# Altium schematic sheet MotorCell_noPow.SchDoc
size A3; DocumentNumber: 2; SheetNumber: 4; SheetTotal: 5
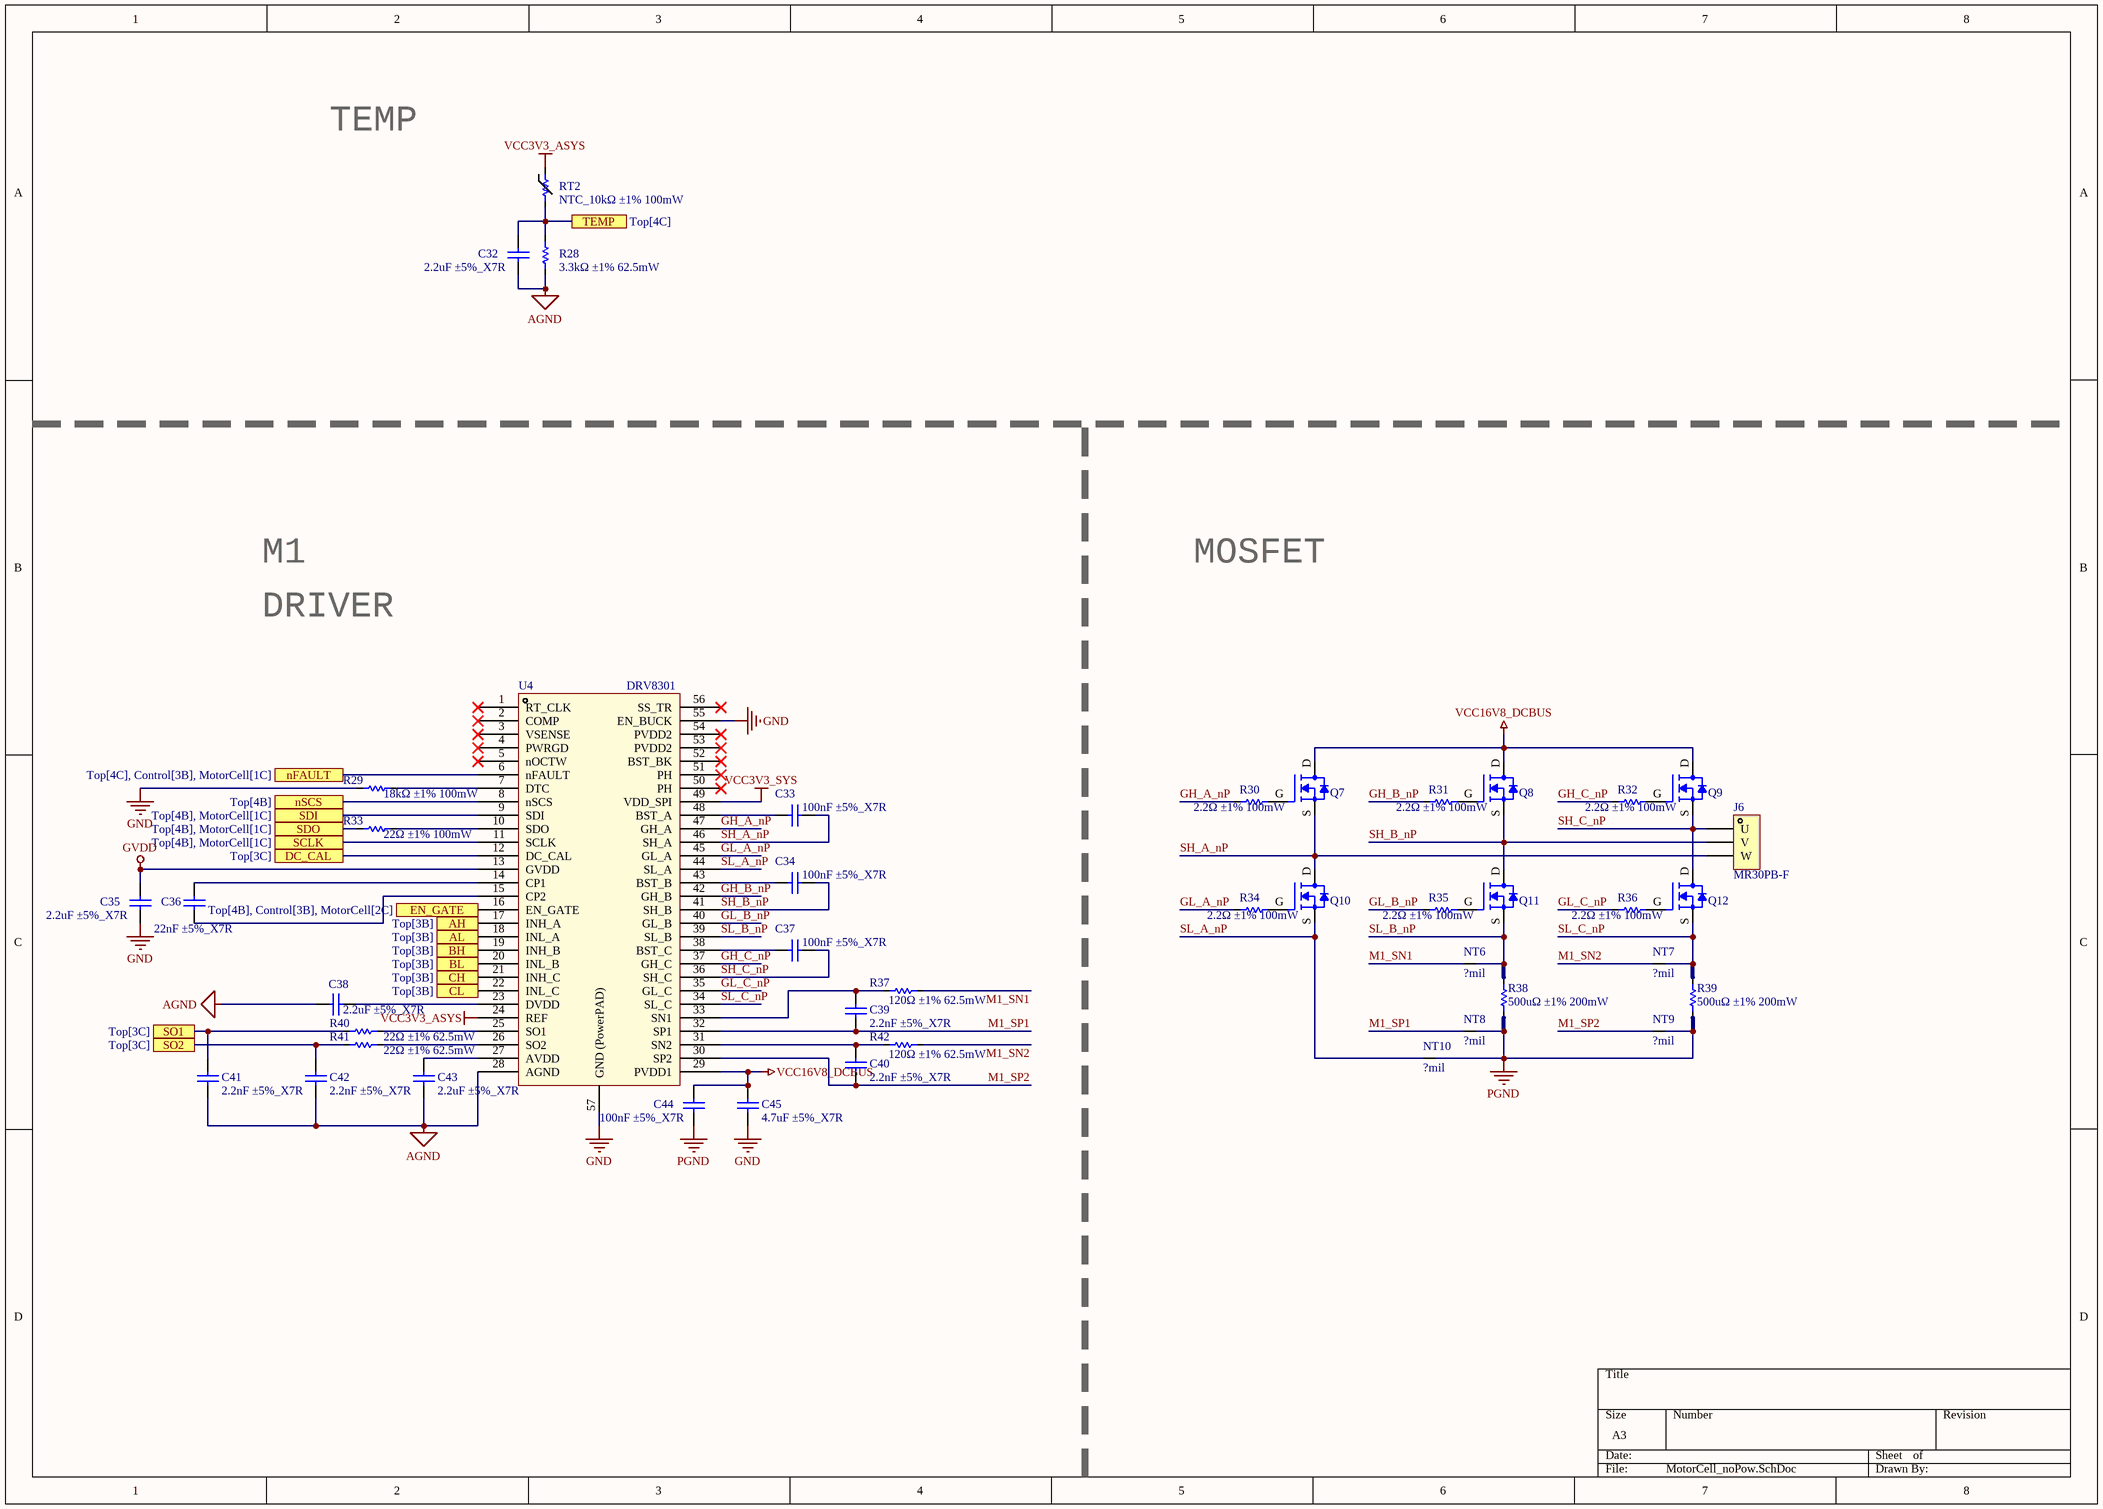
[diagram p0: MotorCell_noPow.SchDoc]

## Parts
C32  2.2uF ±5%_X7R  [C0402]
C33  100nF ±5%_X7R  [C0402]
C34  100nF ±5%_X7R  [C0402]
C35  2.2uF ±5%_X7R  [C0603]
C36  22nF ±5%_X7R  [C0402]
C37  100nF ±5%_X7R  [C0402]
C38  2.2uF ±5%_X7R  [C0603]
C39  2.2nF ±5%_X7R  [C0402]
C40  2.2nF ±5%_X7R  [C0402]
C41  2.2nF ±5%_X7R  [C0402]
C42  2.2nF ±5%_X7R  [C0402]
C43  2.2uF ±5%_X7R  [C0603]
C44  100nF ±5%_X7R  [C0402]
C45  4.7uF ±5%_X7R  [C0603]
J6  MR30PB-F  [MR30PB-F [Straight] [SMT]]
NT6  ?mil  [NETTIE_8mil]  (net tie, no BOM)
NT7  ?mil  [NETTIE_8mil]  (net tie, no BOM)
NT8  ?mil  [NETTIE_8mil]  (net tie, no BOM)
NT9  ?mil  [NETTIE_8mil]  (net tie, no BOM)
NT10  ?mil  [NETTIE_8mil]  (net tie, no BOM)
Q7  NTMFS4935NT1G  [NRVTS10100EMFST1G]  (value not drawn)
Q8  NTMFS4935NT1G  [NRVTS10100EMFST1G]  (value not drawn)
Q9  NTMFS4935NT1G  [NRVTS10100EMFST1G]  (value not drawn)
Q10  NTMFS4935NT1G  [NRVTS10100EMFST1G]  (value not drawn)
Q11  NTMFS4935NT1G  [NRVTS10100EMFST1G]  (value not drawn)
Q12  NTMFS4935NT1G  [NRVTS10100EMFST1G]  (value not drawn)
R28  3.3kΩ ±1% 62.5mW  [R0402]
R29  18kΩ ±1% 100mW  [R0402]
R30  2.2Ω ±1% 100mW  [R0402]
R31  2.2Ω ±1% 100mW  [R0402]
R32  2.2Ω ±1% 100mW  [R0402]
R33  22Ω ±1% 100mW  [R0402]
R34  2.2Ω ±1% 100mW  [R0402]
R35  2.2Ω ±1% 100mW  [R0402]
R36  2.2Ω ±1% 100mW  [R0402]
R37  120Ω ±1% 62.5mW  [R0402]
R38  500uΩ ±1% 200mW  [R2512]
R39  500uΩ ±1% 200mW  [R2512]
R40  22Ω ±1% 62.5mW  [R0402]
R41  22Ω ±1% 62.5mW  [R0402]
R42  120Ω ±1% 62.5mW  [R0402]
RT2  NTC_10kΩ ±1% 100mW  [R0402]
U4  DRV8301  [TSSOP50P810X120_HS-57N]

## Ports
AH (see Top[3B]), AL (see Top[3B]), BH (see Top[3B]), BL (see Top[3B]), CH (see Top[3B]), CL (see Top[3B]), DC_CAL (see Top[3C]), EN_GATE (see Top[4B], Control[3B], MotorCell[2C]), nFAULT (see Top[4C], Control[3B], MotorCell[1C]), nSCS (see Top[4B]), SCLK (see Top[4B], MotorCell[1C]), SDI (see Top[4B], MotorCell[1C]), SDO (see Top[4B], MotorCell[1C]), SO1 (see Top[3C]), SO2 (see Top[3C]), TEMP (see Top[4C])

## Nets
AGND: C32.1 C38.2 C41.1 C42.1 C43.1 R28.1 U4.28(AGND)
GND: C35.1 C45.1 R29.2 U4.55(EN_BUCK) U4.57(GND_(PowerPAD))
GVDD: C35.2 U4.13(GVDD)
PGND: C44.1 NT8.2 NT9.2 NT10.1 R38.1 R39.1
VCC3V3_ASYS: RT2.1 U4.24(REF)
VCC3V3_SYS: U4.49(VDD_SPI)
VCC16V8_DCBUS: C44.2 C45.2 Q7.D Q8.D Q9.D U4.29(PVDD1)
AH: U4.17(INH_A) ; port AH
AL: U4.18(INL_A) ; port AL
BH: U4.19(INH_B) ; port BH
BL: U4.20(INL_B) ; port BL
CH: U4.21(INH_C) ; port CH
CL: U4.22(INL_C) ; port CL
DC_CAL: U4.12(DC_CAL) ; port DC_CAL
EN_GATE: U4.16(EN_GATE) ; port EN_GATE
GH_A_nP: R30.2 U4.47(GH_A)
GH_B_nP: R31.2 U4.42(GH_B)
GH_C_nP: R32.2 U4.37(GH_C)
GL_A_nP: R34.2 U4.45(GL_A)
GL_B_nP: R35.2 U4.40(GL_B)
GL_C_nP: R36.2 U4.35(GL_C)
M1_SN1: NT6.1 R37.1
M1_SN2: NT7.1 R42.1
M1_SP1: C39.1 NT8.1 U4.32(SP1)
M1_SP2: C40.1 NT9.1 U4.30(SP2)
nFAULT: U4.6(nFAULT) ; port nFAULT
nSCS: U4.8(nSCS) ; port nSCS
SCLK: U4.11(SCLK) ; port SCLK
SDI: U4.9(SDI) ; port SDI
SDO: R33.1 ; port SDO
SH_A_nP: C33.1 J6.3(W) Q7.S Q10.D U4.46(SH_A)
SH_B_nP: C34.1 J6.2(V) Q8.S Q11.D U4.41(SH_B)
SH_C_nP: C37.1 J6.1(U) Q9.S Q12.D U4.36(SH_C)
SL_A_nP: NT10.2 Q10.S U4.44(SL_A)
SL_B_nP: NT6.2 Q11.S R38.2 U4.39(SL_B)
SL_C_nP: NT7.2 Q12.S R39.2 U4.34(SL_C)
SO1: C41.2 R40.2 ; port SO1
SO2: C42.2 R41.2 ; port SO2
TEMP: C32.2 R28.2 RT2.2 ; port TEMP
NetC33_2: C33.2 U4.48(BST_A)
NetC34_2: C34.2 U4.43(BST_B)
NetC36_1: C36.1 U4.14(CP1)
NetC36_2: C36.2 U4.15(CP2)
NetC37_2: C37.2 U4.38(BST_C)
NetC38_1: C38.1 U4.23(DVDD)
NetC39_2: C39.2 R37.2 U4.33(SN1)
NetC40_2: C40.2 R42.2 U4.31(SN2)
NetC43_2: C43.2 U4.27(AVDD)
NetQ7_G: Q7.G R30.1
NetQ8_G: Q8.G R31.1
NetQ9_G: Q9.G R32.1
NetQ10_G: Q10.G R34.1
NetQ11_G: Q11.G R35.1
NetQ12_G: Q12.G R36.1
NetR29_1: R29.1 U4.7(DTC)
NetR33_2: R33.2 U4.10(SDO)
NetR40_1: R40.1 U4.25(SO1)
NetR41_1: R41.1 U4.26(SO2)

Not connected (* = marked no-connect by the designer): U4 1(RT_CLK)* 2(COMP)* 3(VSENSE)* 4(PWRGD)* 5(nOCTW)* 50(PH)* 51(PH)* 52(BST_BK)* 53(PVDD2)* 54(PVDD2)* 56(SS_TR)*

## Notes on the sheet
- TEMP
- M1
- MOSFET
- DRIVER

## Library data of the parts
C32-C45 = Cap: Capacitor; Published: 8-Jun-2000; LatestRevisionDate: 17-Jul-2002; LatestRevisionNote: Re-released for DXP Platform.; PackageReference: RAD-0.3; Publisher: Altium Limited; PackageDescription: Radial Cap, Thru-Hole; 2 Leads; 0.3 in Pin Spacing
J6 = MR30PB-F [Straight] [SMT]: 驱动器端
NT6-NT10 = NETTIE
Q7-Q12 = MOSFET-N: MOSFET – Power, Single, / N-Channel, SO-8 FL / 30 V, 93 A; Manufacturer: ON Semiconductor; Drain to Source Voltage (Vdss): 30V; Current - Continuous Drain (Id) @ 25°C: 13A (Ta), 93A (Tc); Drive Voltage (Max Rds On,  Min Rds On): 4.5V, 10V; Vgs(th) (Max) @ Id: 2.2V @ 250µA; Gate Charge (Qg) (Max) @ Vgs: 49.4nC @ 10V; Input Capacitance (Ciss) (Max) @ Vds: 4850pF @ 15V; Vgs (Max): ±20V; Power Dissipation (Max): 930mW (Ta), 48W (Tc); Rds On (Max) @ Id, Vgs: 3.2 mOhm @ 30A, 10V; Supplier 1: Digi-Key; Supplier Part Number 1: NTMFS4935NT1GOSCT-ND; RoHS: RoHS Compliant; Category: Discrete Semiconductor Products; Stock 1: 932; Pricing 1: 1=0.61, 10=0.541, 100=0.4145, 500=0.3277 (USD); Packaging: Cut Tape (CT); Part Status: Active; FET Type: N-Channel; Technology: MOSFET (Metal Oxide); FET Feature: -; Operating Temperature: -55°C ~ 150°C (TJ); Mounting Type: Surface Mount; Supplier Device Package: 5-DFN (5x6) (8-SOFL); Package / Case: 8-PowerTDFN, 5 Leads; ComponentLink1URL: http://www.onsemi.com/pub_link/Collateral/NTMFS4935N-D.PDF; ComponentLink1Description: http://www.onsemi.com/pub_link/Collateral/NTMFS4935N-D.PDF; Manufacturer Part Number: NTMFS4935NT1G
R28-R42 = Res: Resistor; Published: 8-Jun-2000; LatestRevisionDate: 17-Jul-2002; LatestRevisionNote: Re-released for DXP Platform.; PackageReference: AXIAL-0.3; Publisher: Altium Limited; PackageDescription: Axial Device, Thru-Hole; 2 Leads; 0.3 in Pin Spacing
RT2 = TEMP RES: THERMISTOR 10K OHM NTC 0402 SMD
U4 = DRV8301: MOTOR DRIVER, 3PH, 56HTSSOP